# Altium schematic sheet psu.SchDoc: Power Supply (DSP + General)
size A3; SheetNumber: 3; SheetTotal: 18
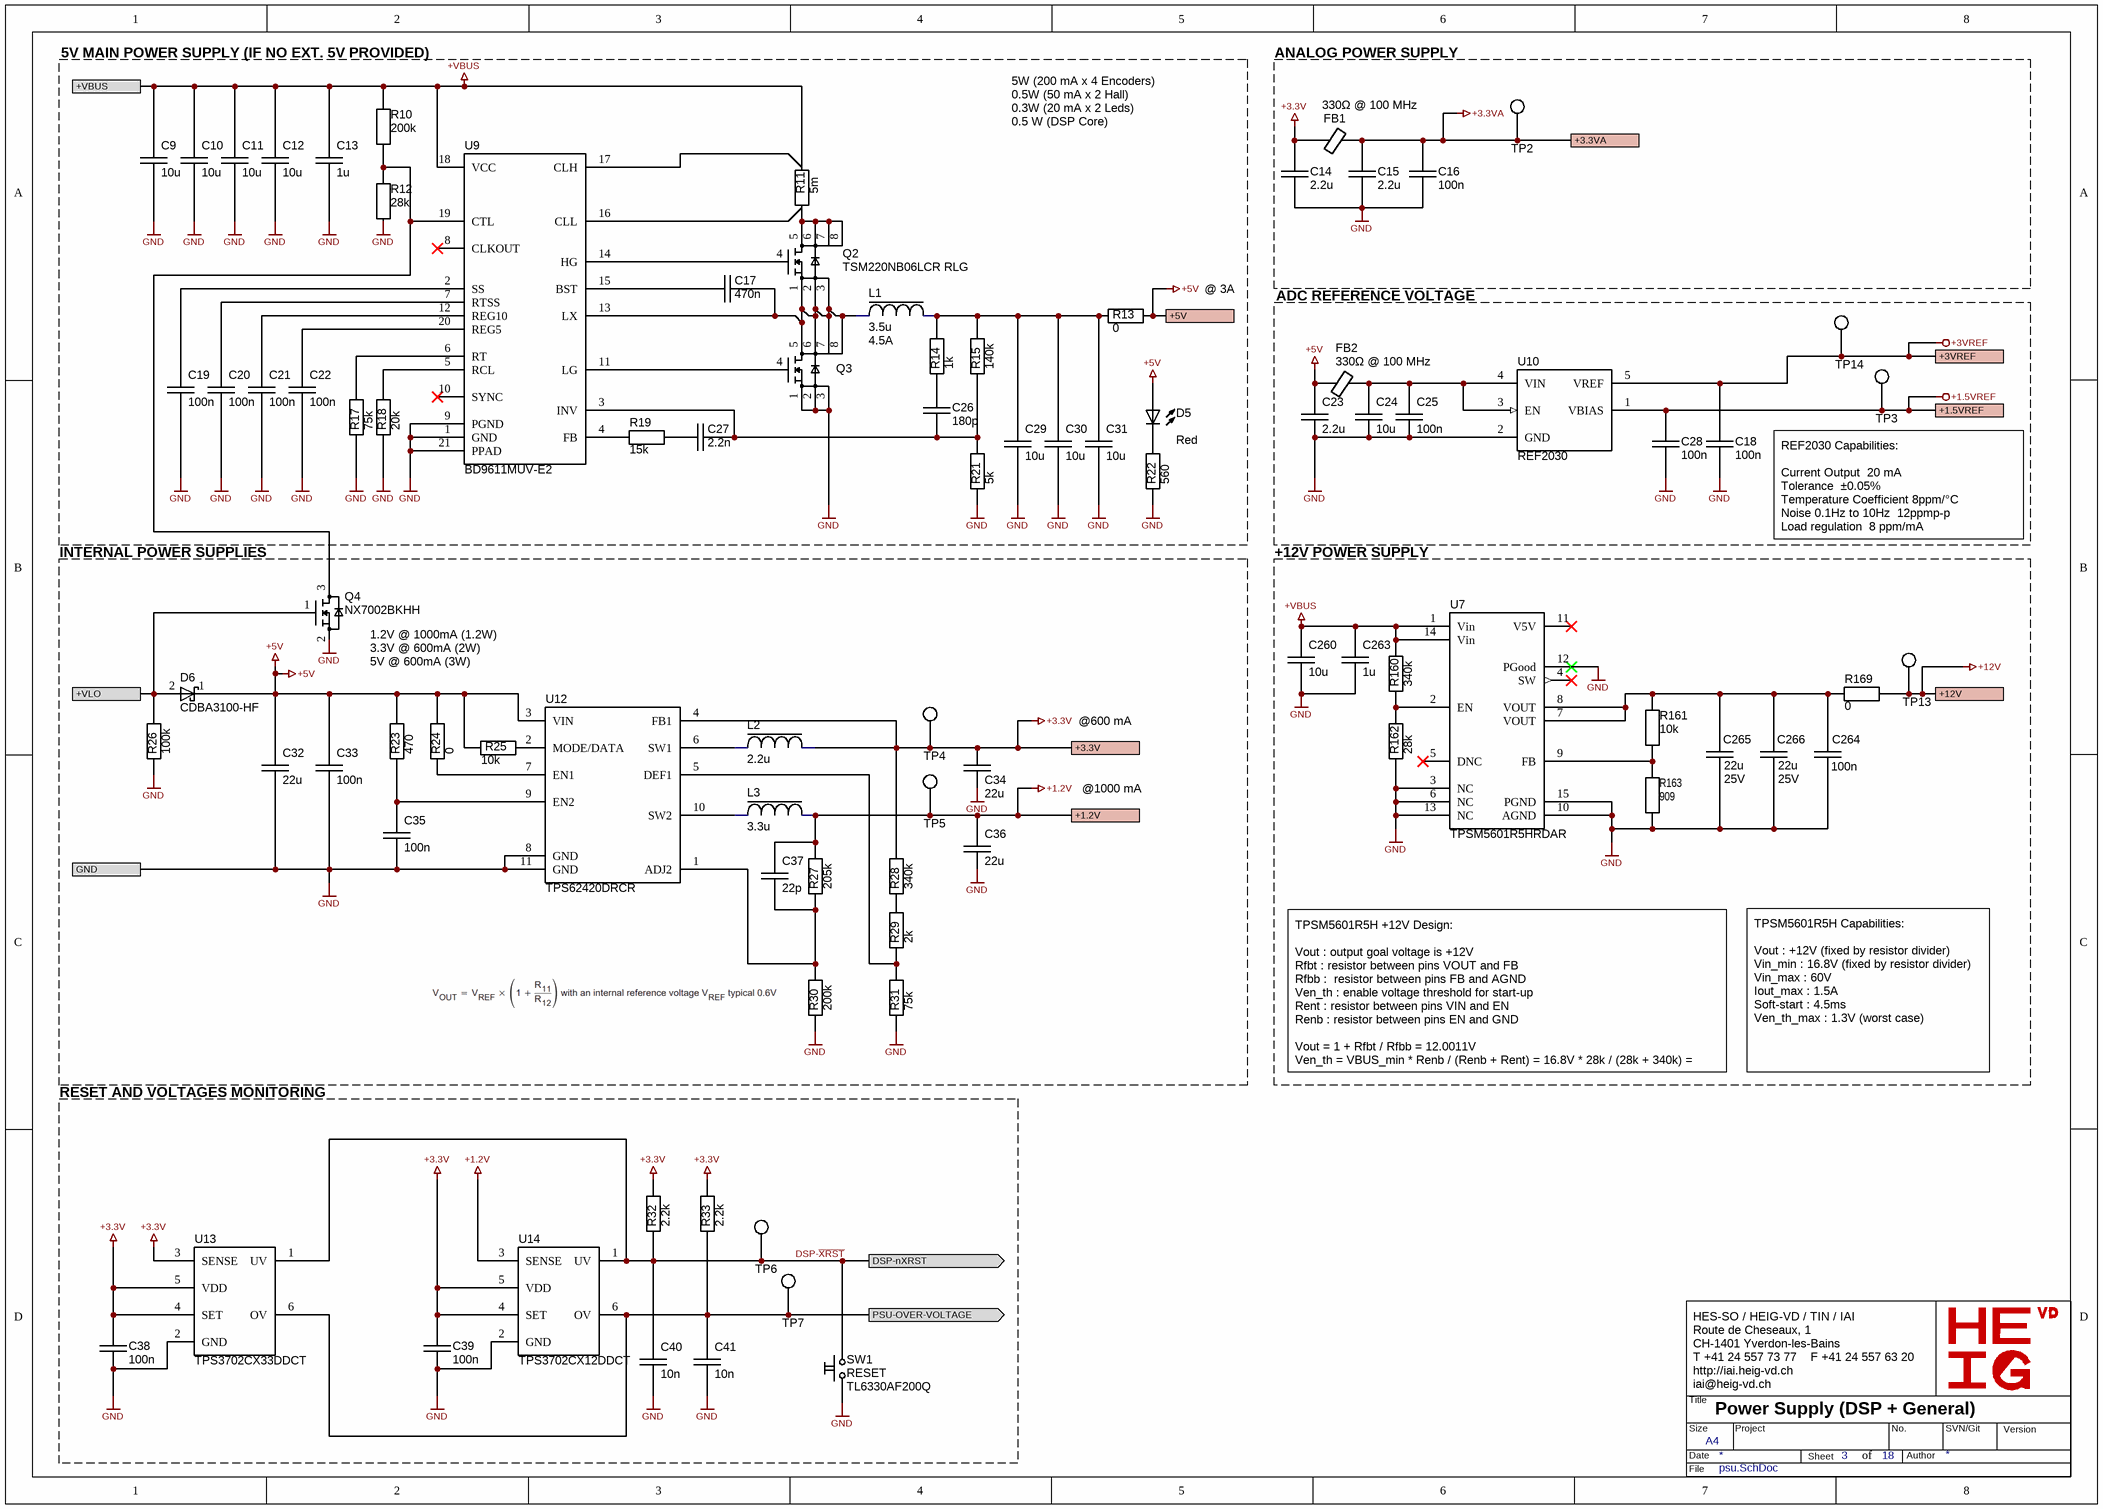
[diagram p0: psu.SchDoc]

## Parts
C9  10u  [SM/C0603]
C10  10u  [SM/C0603]
C11  10u  [SM/C0603]
C12  10u  [SM/C0603]
C13  1u  [SM/C0805]
C14  2.2u  [SM/C0402]
C15  2.2u  [SM/C0402]
C16  100n  [SM/C0402]
C17  470n  [SM/C0402]
C18  100n  [SM/C0402]
C19  100n  [SM/C0402]
C20  100n  [SM/C0402]
C21  100n  [SM/C0402]
C22  100n  [SM/C0402]
C23  2.2u  [SM/C0402]
C24  10u  [SM/C0603]
C25  100n  [SM/C0402]
C26  180p  [SM/C0402]
C27  2.2n  [SM/C0402]
C28  100n  [SM/C0402]
C29  10u  [SM/C0603]
C30  10u  [SM/C0603]
C31  10u  [SM/C0603]
C32  22u  [SM/C0402]
C33  100n  [SM/C0402]
C34  22u  [SM/C0402]
C35  100n  [SM/C0402]
C36  22u  [SM/C0402]
C37  22p  [SM/C0402]
C38  100n  [SM/C0402]
C39  100n  [SM/C0402]
C40  10n  [SM/C0402]
C41  10n  [SM/C0402]
C260  10u  [SM/C0603]
C263  1u  [SM/C0805]
C264  100n  [SM/C0402]
C265  22u  Voltage: 25V  [SM/C0805]
C266  22u  Voltage: 25V  [SM/C0805]
D5  Color: Red  [SM/LED0603]  (hidden comment: 150060SS75000)
D6  CDBA3100-HF  [DO214AC]
FB1  value 330Ω @ 100 MHz  [SM/L0603]  (hidden comment: BLM18KG331SN1D)
FB2  value 330Ω @ 100 MHz  [SM/L0603]  (hidden comment: BLM18KG331SN1D)
L1  value 3.5u  Isat: 4.5A  [IND_1255AY-4R7M=P3]  (hidden comment: 1255AY-4R7M=P3)
L2  2.2u  [SM/L/SRN3010TA]
L3  3.3u  [SM/L/SRN3010TA]
Q2  TSM220NB06LCR RLG  [TRANS_TSM220NB06LCR_RLG]
Q3  TSM220NB06LCR RLG  [TRANS_TSM220NB06LCR_RLG]  (value not drawn)
Q4  NX7002BKHH  [SOT8001/DFN0606-3]
R10  200k  [SM/R0402]
R11  5m  [SM/C0612]
R12  28k  [SM/R0402]
R13  0  [SM/R1206]
R14  1k  [SM/R0402]
R15  140k  [SM/R0402]
R17  75k  [SM/R0402]
R18  20k  [SM/R0402]
R19  15k  [SM/R0402]
R21  5k  [SM/R0402]
R22  560  [SM/R0402]
R23  470  [SM/R0402]
R24  0  [SM/R0402]
R25  10k  [SM/R0402]
R26  100k  [SM/R0805]
R27  205k  [SM/R0402]
R28  340k  [SM/R0402]
R29  2k  [SM/R0402]
R30  200k  [SM/R0402]
R31  75k  [SM/R0402]
R32  2.2k  [SM/R0402]
R33  2.2k  [SM/R0402]
R160  340k  [SM/R0402]
R161  10k  [SM/R0402]
R162  28k  [SM/R0402]
R163  909  [SM/R0402]
R169  0  [SM/R1206]
SW1  RESET  value TL6330AF200Q  [PB TL6330]
TP2  RCUCTE  [TP/RCUCT]  (value not drawn)
TP3  RCUCTE  [TP/RCUCT]  (value not drawn)
TP4  RCUCTE  [TP/RCUCT]  (value not drawn)
TP5  RCUCTE  [TP/RCUCT]  (value not drawn)
TP6  RCUCTE  [TP/RCUCT]  (value not drawn)
TP7  RCUCTE  [TP/RCUCT]  (value not drawn)
TP13  RCUCTE  [TP/RCUCT]  (value not drawn)
TP14  RCUCTE  [TP/RCUCT]  (value not drawn)
U7  TPSM5601R5HRDAR  [TPSM5601R5Hx]
U9  BD9611MUV-E2  [QFN50P400X400X90-21N]
U10  REF2030  [SOT95P280X110-5N]
U12  TPS62420DRCR  [IC_TPS62420DRCR]
U13  TPS3702CX33DDCT  [SOT23-6]
U14  TPS3702CX12DDCT  [SOT23-6]

## Blocks framed on the sheet
5V MAIN POWER SUPPLY (IF NO EXT. 5V PROVIDED): C9-C13 C17 C19-C22 C26 C27 C29-C31 D5 L1 Q2 Q3 R10-R15 R17-R19 R21 R22 U9
ANALOG POWER SUPPLY: C14-C16 FB1 TP2
ADC REFERENCE VOLTAGE: C18 C23-C25 C28 FB2 TP3 TP14 U10
INTERNAL POWER SUPPLIES: C32-C37 D6 L2 L3 Q4 R23-R31 TP4 TP5 U12
+12V POWER SUPPLY: C260 C263-C266 R160-R163 R169 TP13 U7
RESET AND VOLTAGES MONITORING: C38-C41 R32 R33 SW1 TP6 TP7 U13 U14

## Ports
+1.2V, +1.5VREF, +3.3V, +3.3VA, +3VREF, +5V, +12V, +VBUS, +VLO, DSP-nXRST (out), GND, PSU-OVER-VOLTAGE (out)

## Nets
+1.2V: C36.1 C37.1 L3.1 R27.1 TP5.1 U14.3(SENSE) ; port +1.2V
+1.5VREF: C28.1 TP3.1 U10.1(VBIAS) ; port +1.5VREF
+3.3V: C14.1 C34.1 C38.1 C39.1 FB1.1 L2.1 R28.1 R32.1 R33.1 TP4.1 U12.4(FB1) U13.3(SENSE) U13.4(SET) U13.5(VDD) U14.4(SET) U14.5(VDD) ; port +3.3V
+3.3VA: C15.1 C16.1 FB1.2 TP2.1 ; port +3.3VA
+3VREF: C18.1 TP14.1 U10.5(VREF) ; port +3VREF
+5V: C23.1 C32.1 C33.1 D5.1 D6.1(K) FB2.1 R13.1 R23.2 R24.2 R25.2 U12.3(VIN) ; port +5V
+12V: R169.1 TP13.1 ; port +12V
+VBUS: C9.1 C10.1 C11.1 C12.1 C13.1 C260.1 C263.1 R10.2 R11.3 R160.1 U7.1(Vin) U7.14(Vin) U9.18(VCC) ; port +VBUS
GND: C9.2 C10.2 C11.2 C12.2 C13.2 C14.2 C15.2 C16.2 C18.2 C19.2 C20.2 C21.2 C22.2 C23.2 C24.2 C25.2 C28.2 C29.2 C30.2 C31.2 C32.2 C33.2 C34.2 C35.2 C36.2 C38.2 C39.2 C40.2 C41.2 C260.2 C263.2 C264.2 C265.1 C266.1 Q3.1(S) Q3.2(S) Q3.3(S) Q4.2(VCC) R12.1 R17.1 R18.1 R21.1 R22.1 R26.1 R30.2 R31.2 R162.1 R163.1 SW1.1 U7.3(NC) U7.6(NC) U7.10(AGND) U7.12(PGood) U7.13(NC) U7.15(PGND) U9.1(GND) U9.9(PGND) U9.21(PPAD) U10.2(GND) U12.8(GND) U12.11(GND) U13.2(GND) U14.2(GND) ; port GND
+VLO: D6.2(A) Q4.1(VCC) R26.2 ; port +VLO
DSP-~{XRST}: C40.1 R32.2 SW1.2 TP6.1 U13.1(UV) U14.1(UV) ; port DSP-nXRST
PSU-OVER-VOLTAGE: C41.1 R33.2 TP7.1 U13.6(OV) U14.6(OV) ; port PSU-OVER-VOLTAGE
NetC17_1: C17.1 U9.15(BST)
NetC17_2: C17.2 L1.2 Q2.1(S) Q2.2(S) Q2.3(S) Q3.5(D) Q3.6(D) Q3.7(D) Q3.8(D) U9.13(LX)
NetC19_1: C19.1 U9.2(SS)
NetC20_1: C20.1 U9.7(RTSS)
NetC21_1: C21.1 U9.12(REG10)
NetC22_1: C22.1 U9.20(REG5)
NetC24_1: C24.1 C25.1 FB2.2 U10.3(EN) U10.4(VIN)
NetC26_1: C26.1 R14.1
NetC26_2: C26.2 C27.1 R15.1 R21.2 U9.3(INV)
NetC27_2: C27.2 R19.2
NetC29_1: C29.1 C30.1 C31.1 L1.1 R13.2 R14.2 R15.2
NetC35_1: C35.1 R23.1 U12.9(EN2)
NetC37_2: C37.2 R27.2 R30.1 U12.1(ADJ2)
NetC264_1: C264.1 C265.2 C266.2 R161.1 R169.2 U7.7(VOUT) U7.8(VOUT)
NetD5_2: D5.2 R22.2
NetL2_2: L2.2 U12.6(SW1)
NetL3_2: L3.2 U12.10(SW2)
NetQ2_4: Q2.4(Gate) U9.14(HG)
NetQ2_5: Q2.5(D) Q2.6(D) Q2.7(D) Q2.8(D) R11.2
NetQ3_4: Q3.4(Gate) U9.11(LG)
NetQ4_3: Q4.3(VCC) R10.1 R12.2 U9.19(CTL)
NetR11_1: R11.1 U9.16(CLL)
NetR11_4: R11.4 U9.17(CLH)
NetR17_2: R17.2 U9.6(RT)
NetR18_2: R18.2 U9.5(RCL)
NetR19_1: R19.1 U9.4(FB)
NetR24_1: R24.1 U12.7(EN1)
NetR25_1: R25.1 U12.2(MODE/DATA)
NetR28_2: R28.2 R29.1
NetR29_2: R29.2 R31.1 U12.5(DEF1)
NetR160_2: R160.2 R162.2 U7.2(EN)
NetR161_2: R161.2 R163.2 U7.9(FB)

Not connected (* = marked no-connect by the designer): U7 4(SW)* 5(DNC)* 11(V5V)*; U9 8(CLKOUT)* 10(SYNC)*

## Notes on the sheet
- 5W (200 mA x 4 Encoders)
  0.5W (50 mA x 2 Hall)
  0.3W (20 mA x 2 Leds)
  0.5 W (DSP Core)
- @ 3A
- REF2030 Capabilities:
  Current Output		20 mA
  Tolerance		±0.05%
  Temperature Coefficient	8ppm/°C
  Noise 0.1Hz to 10Hz		12ppmp-p
  Load regulation		8 ppm/mA
- 1.2V @ 1000mA (1.2W)
  3.3V @ 600mA (2W)
  5V @ 600mA (3W)
- @600 mA
- @1000 mA
- TPSM5601R5H +12V Design:
  Vout : output goal voltage is +12V
  Rfbt : resistor between pins VOUT and FB
  Rfbb :  resistor between pins FB and AGND
  Ven_th : enable voltage threshold for start-up
  Rent : resistor between pins VIN and EN
  Renb : resistor between pins EN and GND
  Vout = 1 + Rfbt / Rfbb = 12.0011V
  Ven_th = VBUS_min * Renb / (Renb + Rent) = 16.8V * 28k / (28k + 340k) = 1.3V
- TPSM5601R5H Capabilities:
  Vout : +12V (fixed by resistor divider)
  Vin_min : 16.8V (fixed by resistor divider)
  Vin_max : 60V
  Iout_max : 1.5A
  Soft-start : 4.5ms
  Ven_th_max : 1.3V (worst case)
- HES-SO / HEIG-VD / TIN / IAI
  Route de Cheseaux, 1
  CH-1401 Yverdon-les-Bains
  T +41 24 557 73 77    F +41 24 557 63 20
  http://iai.heig-vd.ch
  iai@heig-vd.ch
- Title
- Size
- Date
- A4
- Project
- Sheet
- of
- No.
- Author
- SVN/Git
- Version
- File

## Library data of the parts
C9-C12 C24 C29-C31 C260 = CAP CER 10UF 25V X5R 0603: 10 µF ±20% 25V Ceramic Capacitor X5R 0603 (1608 Metric); Dielectric: X7R; Voltage: 25V; Supplier 1: Digi-Key; Supplier Part Number 1: 490-7202-1-ND; Value: 10u
C13 C263 = CAP CER 1UF 100V X7S 0805: 1 µF ±10% 100V Ceramic Capacitor X7S 0805 (2012 Metric); Voltage: 100V; Dielectric: X7S; Supplier 1: Digi-Key; Supplier Part Number 1: 490-10918-1-ND; Value: 1u
C14 C15 C23 = CAP CER 2.2UF 16V X5R 0402: 2.2 µF ±10% 16V Ceramic Capacitor X5R 0402 (1005 Metric); Voltage: 16V; Supplier 1: Digi-Key; Supplier Part Number 1: 490-10695-1-ND; Dielectric: X5R; Value: 2.2u
C16 C18-C22 C25 C28 C33 C35 C38 C39 C264 = CAP CER 100NF 25V X5R 0402: 100 nF ±10% 25V Ceramic Capacitor X5R 0402 (1005 Metric); Voltage: 25V; Dielectric: X5R; Supplier 1: Digi-Key; Supplier Part Number 1: 1276-1043-1-ND; Value: 100n
C17 = CAP CER 470NF 50V X5R 0402: 470 nF ±10% 50V Ceramic Capacitor X5R 0402 (1005 Metric); Voltage: 50V; Dielectric: X5R; Value: 470n; Supplier 1: Digi-Key; Supplier Part Number 1: 490-16354-1-ND
C26 = CAP CER 180PF 50V C0G/NP0 0402: 180 pF ±5% 50V Ceramic Capacitor C0G, NP0 0402 (1005 Metric); Dielectric: NPO; Voltage: 50V; Supplier 1: Digi-Key; Supplier Part Number 1: 490-GCM1555C1H181JA16DCT-ND; Value: 180p
C27 = CAP CER 2.2NF 50V X7R 0402: 2.2 nF ±10% 50V Ceramic Capacitor X7R 0402 (1005 Metric); Voltage: 50V; Dielectric: X7R; Supplier 1: Digi-Key; Supplier Part Number 1: 311-3072-1-ND
C32 C34 C36 = CAP CER 22UF 6.3V X5R 0402: 22 µF ±20% 6.3V Ceramic Capacitor X5R 0402 (1005 Metric); Voltage: 6.3V; Dielectric: X5R; Supplier 1: Digi-Key; Supplier Part Number 1: 478-KGM05CR50J226MHCT-ND; Value: 22u
C37 = CAP CER 22PF 50V C0G/NPO 0402: 22 pF ±2% 50V Ceramic Capacitor C0G, NP0 0402 (1005 Metric); Dielectric: NPO; Voltage: 50V; Supplier 1: Digi-Key; Supplier Part Number 1: 311-1652-1-ND; Value: 22p
C40 C41 = CAP CER 10NF 50V X7R 0402: 10 nF ±10% 50V Ceramic Capacitor X7R 0402 (1005 Metric); Voltage: 50V; Dielectric: X7R; Supplier 1: Digi-Key; Supplier Part Number 1: 1276-1028-1-ND; Value: 10n
C265 C266 = CAP CER 22UF 25V X5R 0805: 22 µF ±20% 25V Ceramic Capacitor X5R 0805 (2012 Metric); Dielectric: X5R; Supplier 1: Digi-Key; Supplier Part Number 1: 490-14661-1-ND
D5 = LED RED CLEAR 0603 SMD: Red 630nm LED Indication - Discrete 1.9V 0603 (1608 Metric); Supplier 1: Digi-Key; Supplier Part Number 1: 732-4979-1-ND
D6 = DIODE SCHOTTKY 100V 3A DO214AC: Diode 100 V 3A Surface Mount DO-214AC (SMA); Supplier 1: Digi-Key; Supplier Part Number 1: 641-1747-1-ND
FB1 FB2 = FERRITE BEAD 330 OHM 0603 1LN: 330 Ohms @ 100 MHz 1 Power Line Ferrite Bead 0603 (1608 Metric) 1.7A 80mOhm; Supplier 1: Digi-Key; Supplier Part Number 1: 490-5256-1-ND
L1 = 1255AY-4R7M=P3: 4.7 µH Shielded Drum Core, Wirewound Inductor 4 A 23mOhm Nonstandard; Supplier 1: Digi-Key; Supplier Part Number 1: 490-10812-1-ND
L2 = SRN3010TA-2R2M: 2.2 µH Semi-Shielded Drum Core, Wirewound Inductor 1.7 A 90mOhm Nonstandard; Isat: 1.3A; Value: 2.2u; Supplier 1: Digi-Key; Supplier Part Number 1: SRN3010TA-2R2MCT-ND
L3 = SRN3010TA-3R3M: 3.3 µH Semi-Shielded Drum Core, Wirewound Inductor 1.5 A 130mOhm Nonstandard; Isat: 1.1A; Value: 3.3u; Supplier 1: Digi-Key; Supplier Part Number 1: SRN3010TA-3R3MCT-ND
Q2 Q3 = BSC0502NSIATMA1: N-Channel 60 V 8A (Ta), 35A (Tc) 3.1W (Ta), 68W (Tc) Surface Mount 8-PDFN (5x6); Supplier 1: Digi-Key; Supplier Part Number 1: TSM220NB06LCRRLGCT-ND
Q4 = 2N7002: N-Channel 60 V 350mA (Ta) 380mW (Ta), 2.8W (Tc) Surface Mount DFN0606-3; Value: 2N7002; Supplier 1: Digi-Key; Supplier Part Number 1: 1727-8574-1-ND
R10 R30 = RES 200K OHM 1% 1/16W 0402: 200 kOhms ±1% 0.063W, 1/16W Chip Resistor 0402 (1005 Metric) Moisture Resistant Thick Film; Value: 200k; Supplier 1: Digi-Key; Supplier Part Number 1: 311-200KLRCT-ND
R11 = RES 0.005 OHM 1W 1206 WIDE: 5 mOhms ±1% 1W Chip Resistor Wide 1206 (3216 Metric), 0612 Automotive AEC-Q200, Current Sense Metal Foil; Supplier 1: Digi-Key; Supplier Part Number 1: 408-1969-1-ND; Value: 5m
R12 R162 = RES 28K OHM 1% 1/16W 0402: 28 kOhms ±1% 0.063W, 1/16W Chip Resistor 0402 (1005 Metric) Moisture Resistant Thick Film; Supplier 1: Digi-Key; Supplier Part Number 1: 311-28.0KLRCT-ND; Value: 28k
R13 R169 = RES 0 OHM JUMPER 1/4W 1206: 0 Ohms Jumper Chip Resistor 1206 (3216 Metric) Automotive AEC-Q200 Thick Film; Supplier 1: Digi-Key; Supplier Part Number 1: RMCF1206ZT0R00CT-ND; Value: 0
R14 = RES 1K OHM 1% 1/16W 0402: 1 kOhms ±1% 0.063W, 1/16W Chip Resistor 0402 (1005 Metric) Moisture Resistant Thick Film; Supplier 1: Digi-Key; Supplier Part Number 1: 311-1.00KLRCT-ND; Value: 1k
R15 = RES 140K OHM 1% 1/16W 0402: 140 kOhms ±1% 0.063W, 1/16W Chip Resistor 0402 (1005 Metric) Moisture Resistant Thick Film; Supplier 1: Digi-Key; Supplier Part Number 1: YAG2978CT-ND; Value: 140k
R17 R31 = RES 75K OHM 1% 1/16W 0402: 75 kOhms ±1% 0.063W, 1/16W Chip Resistor 0402 (1005 Metric) Moisture Resistant Thick Film; Supplier 1: Digi-Key; Supplier Part Number 1: 311-75KLRCT-ND; Value: 75k
R18 = RES 20K OHM 1% 1/16W 0402: 20 kOhms ±1% 0.063W, 1/16W Chip Resistor 0402 (1005 Metric) Moisture Resistant Thick Film; Supplier 1: Digi-Key; Supplier Part Number 1: 311-20.0KLRCT-ND; Value: 20k
R19 = RES 15K OHM 1% 1/16W 0402: 15 kOhms ±1% 0.063W, 1/16W Chip Resistor 0402 (1005 Metric) Thick Film; Value: 15k; Supplier 1: Digi-Key; Supplier Part Number 1: 13-RC0402FR-1015KLCT-ND
R21 = RES 5K OHM 1% 1/16W 0402: 5 kOhms ±1% 0.063W, 1/16W Chip Resistor 0402 (1005 Metric) Moisture Resistant Thick Film; Supplier 1: Digi-Key; Supplier Part Number 1: 13-RC0402FR-075KLCT-ND; Value: 5k
R22 = RES 560 OHM 1% 1/16W 0402: 560 Ohms ±1% 0.063W, 1/16W Chip Resistor 0402 (1005 Metric) Thick Film; Value: 560; Supplier 1: Digi-Key; Supplier Part Number 1: 13-RC0402FR-13560RLCT-ND
R23 = RES 470 OHM 1% 1/16W 0402: 470 Ohms ±1% 0.063W, 1/16W Chip Resistor 0402 (1005 Metric) Thick Film; Value: 470; Supplier 1: Digi-Key; Supplier Part Number 1: 13-RC0402FR-13470RLCT-ND
R24 = RES SMD 0 OHM JUMPER 1/10W 0402: 0 Ohms Jumper Chip Resistor 0402 (1005 Metric) Automotive AEC-Q200 Thick Film; Supplier 1: Digi-Key; Supplier Part Number 1: P0.0JCT-ND; Value: 0
R25 R161 = RES 10K OHM 1% 1/16W 0402: 10 kOhms ±1% 0.063W, 1/16W Chip Resistor 0402 (1005 Metric) Moisture Resistant Thick Film; Supplier 1: Digi-Key; Supplier Part Number 1: 1276-3431-1-ND; Value: 10k
R26 = RES 100K OHM 1% 1/16W 0402: 100 kOhms ±1% 0.063W, 1/16W Chip Resistor 0402 (1005 Metric) Moisture Resistant Thick Film; Supplier 1: Digi-Key; Supplier Part Number 1: 13-RC0402FR-13100KLCT-ND; Value: 100k
R27 = RES 205K OHM 1% 1/16W 0402: 205 kOhms ±1% 0.063W, 1/16W Chip Resistor 0402 (1005 Metric) Moisture Resistant Thick Film; Value: 205k; Supplier 1: Digi-Key; Supplier Part Number 1: YAG3050CT-ND
R28 R160 = RES 340K OHM 1% 1/16W 0402: 340 kOhms ±1% 0.063W, 1/16W Chip Resistor 0402 (1005 Metric) Moisture Resistant Thick Film; Value: 340k; Supplier 1: Digi-Key; Supplier Part Number 1: YAG3121CT-ND
R29 = RES SMD 2K OHM 0.5% 1/16W 0402: 2 kOhms ±0.5% 0.063W, 1/16W Chip Resistor 0402 (1005 Metric) Thin Film; Supplier 1: Digi-Key; Supplier Part Number 1: RR05P2.0KDCT-ND; Value: 2k
R32 R33 = RES 2.2K OHM 1% 1/16W 0402: 2.2 kOhms ±1% 0.063W, 1/16W Chip Resistor 0402 (1005 Metric) Moisture Resistant Thick Film; Supplier 1: Digi-Key; Supplier Part Number 1: 311-2.20KLRCT-ND; Value: 2.2k
R163 = RES 909 OHM 1% 1/16W 0402: 909 Ohms ±1% 0.063W, 1/16W Chip Resistor 0402 (1005 Metric) Moisture Resistant Thick Film; Supplier 1: Digi-Key; Supplier Part Number 1: YAG3256CT-ND
SW1 = SWTICH (1): Supplier 1: Digi-Key; Supplier Part Number 1: EG5546CT-ND
TP2-TP7 TP13 TP14 = TP: PC Test Point Plating Surface Mount Mounting Type; Supplier 1: Digi-Key; Supplier Part Number 1: 2019-RCUCTECT-ND
U7 = TPSM5601R5HRDAR: Non-Isolated PoL Module DC DC Converter 1 Output 1 ~ 16V 1.5A 4.2V - 60V Input; Supplier 1: Digi-Key; Supplier Part Number 1: 296-TPSM5601R5HRDARCT-ND
U9 = BD9611: Buck Regulator Positive Output Step-Down DC-DC Controller IC VQFN020V4040; Supplier 1: Digi-Key; Supplier Part Number 1: BD9611MUV-E2CT-ND; Supplier 2: Mouser; Supplier Part Number 2: 755-BD9611MUV-E2
U10 = REF2030: Series Voltage Reference IC Fixed 1.5V, 3V V ±0.05% 20 mA SOT-23-THIN; Supplier 1: Digi-Key; Supplier Part Number 1: 296-38496-1-ND
U13 = TPS3702CX33DDCT: Supervisor Open Drain or Open Collector 1 Channel SOT-23-THIN; Supplier 1: Digi-Key; Supplier Part Number 1: 296-39651-1-ND
U14 = TPS3702CX12DDCT: Supervisor Open Drain or Open Collector 1 Channel SOT-23-THIN; Supplier 1: Digi-Key; Supplier Part Number 1: 296-42074-1-ND
U12 = TPS62420DRCR: Supplier 1: Digi-Key; Supplier Part Number 1: 296-25650-6-ND